# EasyEDA schematic 1-Schematic_Coax power supply, fixed voltage (SMD, ENCLOSURE).json
TITLE: Coax power supply, fixed voltage (SMD, ENCLOSURE): Main module; REV: 1.0.EE; Date: 2020-04-14; Sheet: 1/1; Drawn By: IgrikXD; Company: Easy-SDR
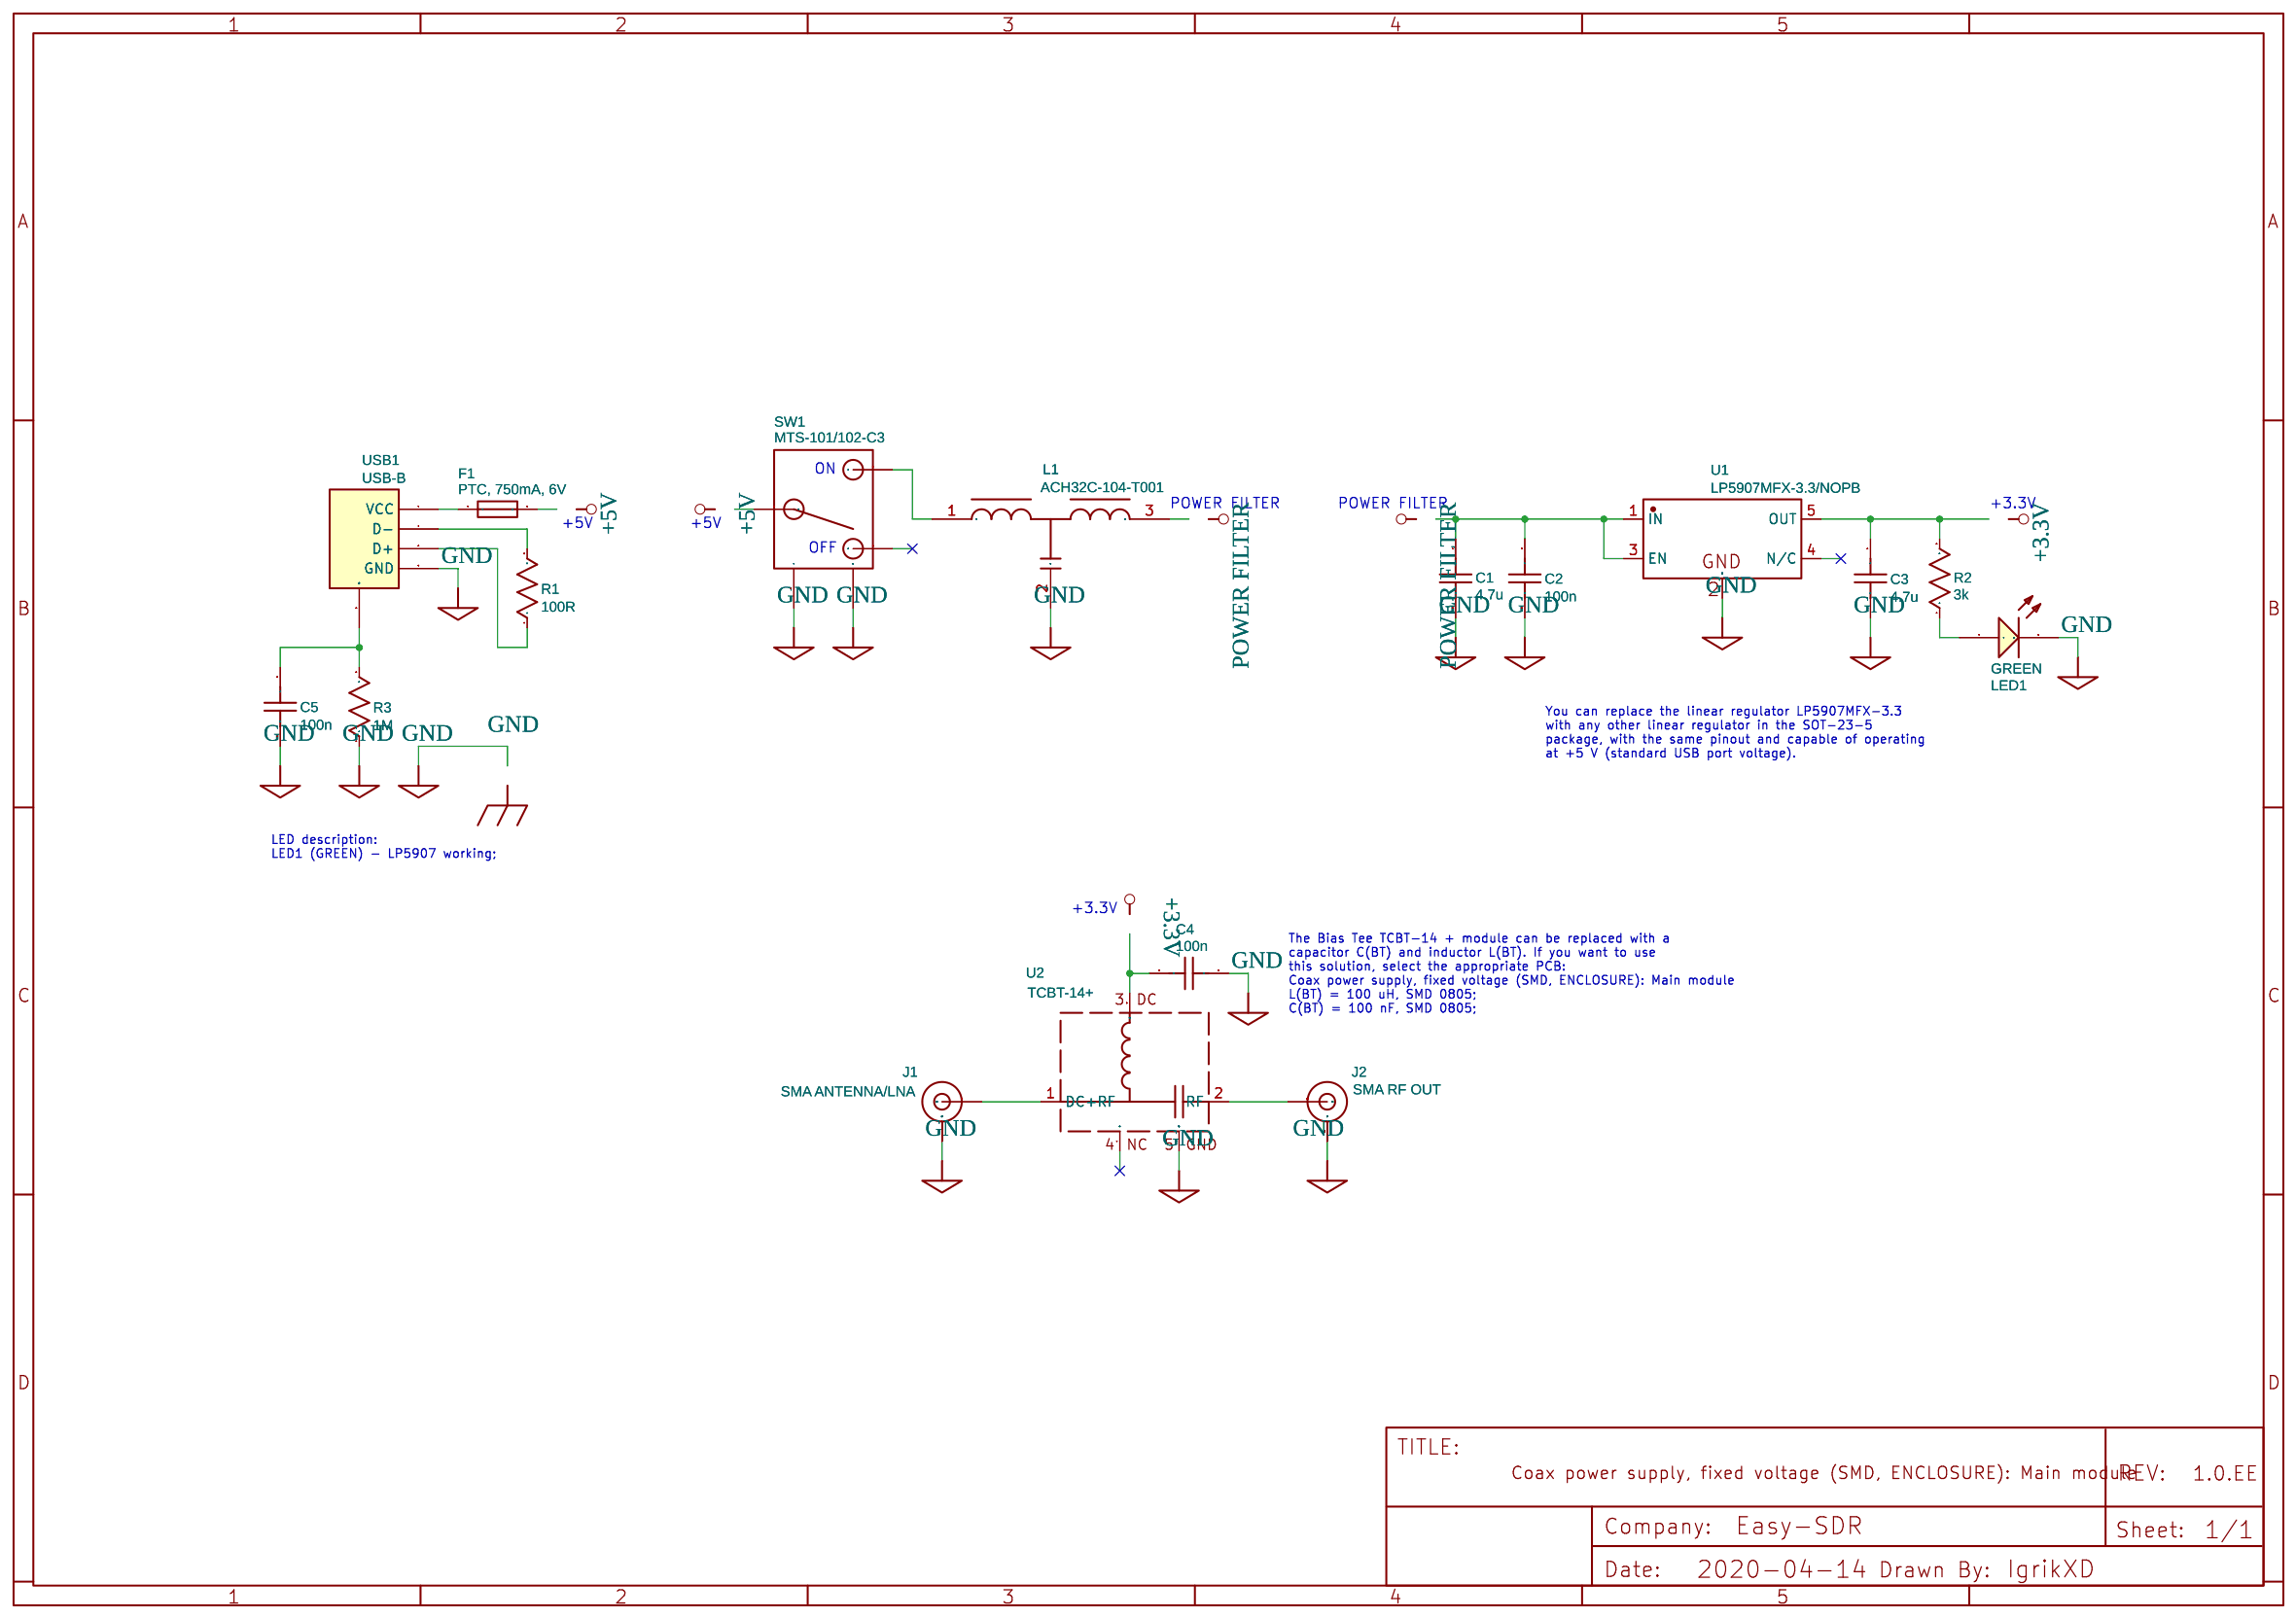
[diagram p0: schematic sheet]

## Parts
C1  4.7u  [0805]
C2  100n  [0805]
C3  4.7u  [0805]
C4  100n  [0805]
C5  100n  [0805]
F1  PTC, 750mA, 6V  [0805]
J1  SMA ANTENNA/LNA  [SMA-EDGE]
J2  SMA RF OUT  [SMA-EDGE]
L1  ACH32C-104-T001  [FILTER-SMD_3P-L3.2-W1.6_ACH32C]
LED1  GREEN  [LED-0805]
R1  100R  [0805]
R2  3k  [0805]
R3  1M  [0805]
SW1  MTS-101/102-C3  [MTS-102-C3]
U1  LP5907MFX-3.3/NOPB  [SOT-23-5]
U2  TCBT-14+  [GU1414 (SPCB) WITHOUT MASK]
USB1  USB-B  [USB TYPE B]

## Library data of the parts
C1 C3 = Capacitor: Manufacturer Part: CL21A475KOFNNNE; Supplier: LCSC; Manufacturer: Samsung Electro-Mechanics; Supplier Part: C1746
C2 C4 C5 = Capacitor: Manufacturer Part: 0805B104J250; Supplier: LCSC; Manufacturer: Walsin Tech Corp; Supplier Part: C163184
F1 = -: Supplier: LCSC; Supplier Part: C116173; Manufacturer: BOURNS; Manufacturer Part: MF-PSMF075X-2; Contributor: LCSC
J1 J2 = -: Contributor: IgrikXD; Manufacturer Part: ANKX01.0093; Supplier: LCSC; Supplier Part: C129604; Manufacturer: RFsister
L1 = ACH32C-104-T001: Supplier: LCSC; Manufacturer: TDK; Supplier Part: C20540
LED1 = -: Supplier: LCSC; Manufacturer: Foshan NationStar Optoelectronics; Manufacturer Part: NCD0805G1; Supplier Part: C84260
R1 = Resistor: Manufacturer Part: RTT051000FTP; Supplier: LCSC; Manufacturer: RALEC; Supplier Part: C103902
R2 = Resistor: Manufacturer Part: RTT05302JTP; Supplier: LCSC; Manufacturer: RALEC; Supplier Part: C104211
R3 = Resistor: Manufacturer Part: RC0805FR-071ML; Supplier: LCSC; Manufacturer: YAGEO; Supplier Part: C107700
SW1 = -: Contributor: snhunter; sourceId: LjTecMmIi; Manufacturer Part: NULL; Supplier: Ebay; Manufacturer: NULL
U1 = -: Supplier: LCSC; Supplier Part: C80670; Manufacturer: Texas Instruments; Contributor: IgrikXD
U2 = TCBT-14+: sourceId: zhN5Zhasm; Contributor: IgrikXD; Supplier: Mini-Circuits; Manufacturer: Mini-Circuits
USB1 = -: Supplier Part: C46392; Supplier: LCSC; Manufacturer: Jing Extension of the Electronic Co.; Manufacturer Part: C46392

## Nets
+3.3V: C3.2 C4.2 R2.2 U1.5(OUT) U2.3(DC)
+5V: F1.2 SW1.2
GND: C1.2 C2.1 C3.1 C4.1 C5.1 J1.GND@0(GND) J1.GND@1(GND) J1.GND@2(GND) J1.GND@3(GND) J2.GND@0(GND) J2.GND@1(GND) J2.GND@2(GND) J2.GND@3(GND) L1.2 LED1.2(C) R3.1 SW1.4 SW1.5 U1.2(GND) U2.5(GND) USB1.2(GND)
POWER FILTER: C1.1 C2.2 L1.3 U1.1(IN) U1.3(EN)
Net-(C5-2): C5.2 R3.2 USB1.5(CASE)
Net-(F1-1): F1.1 USB1.1(VCC)
Net-(J1-SIG): J1.SIG(SIGNAL) U2.1(DC+RF)
Net-(J2-SIG): J2.SIG(SIGNAL) U2.2(RF)
Net-(L1-1): L1.1 SW1.1
Net-(LED1-1): LED1.1(A) R2.1
Net-(R1-1): R1.1 USB1.3(D+)
Net-(R1-2): R1.2 USB1.4(D-)

Not connected (* = marked no-connect by the designer): SW1 3; U1 4(N/C); U2 4(NC)

## Notes on the sheet
- ON
- POWER FILTER
- POWER FILTER
- +3.3V
- +5V
- +5V
- OFF
- You can replace the linear regulator LP5907MFX-3.3
  with any other linear regulator in the SOT-23-5
  package, with the same pinout and capable of operating
  at +5 V (standard USB port voltage).
- LED description:
  LED1 (GREEN) - LP5907 working;
- +3.3V
- The Bias Tee TCBT-14 + module can be replaced with a
  capacitor С(BT) and inductor L(BT). If you want to use
  this solution, select the appropriate PCB:
  Coax power supply, fixed voltage (SMD, ENCLOSURE): Main module
  L(BT) = 100 uH, SMD 0805;
  C(BT) = 100 nF, SMD 0805;
